# Altium project fotopolim_v0.PrjPCB
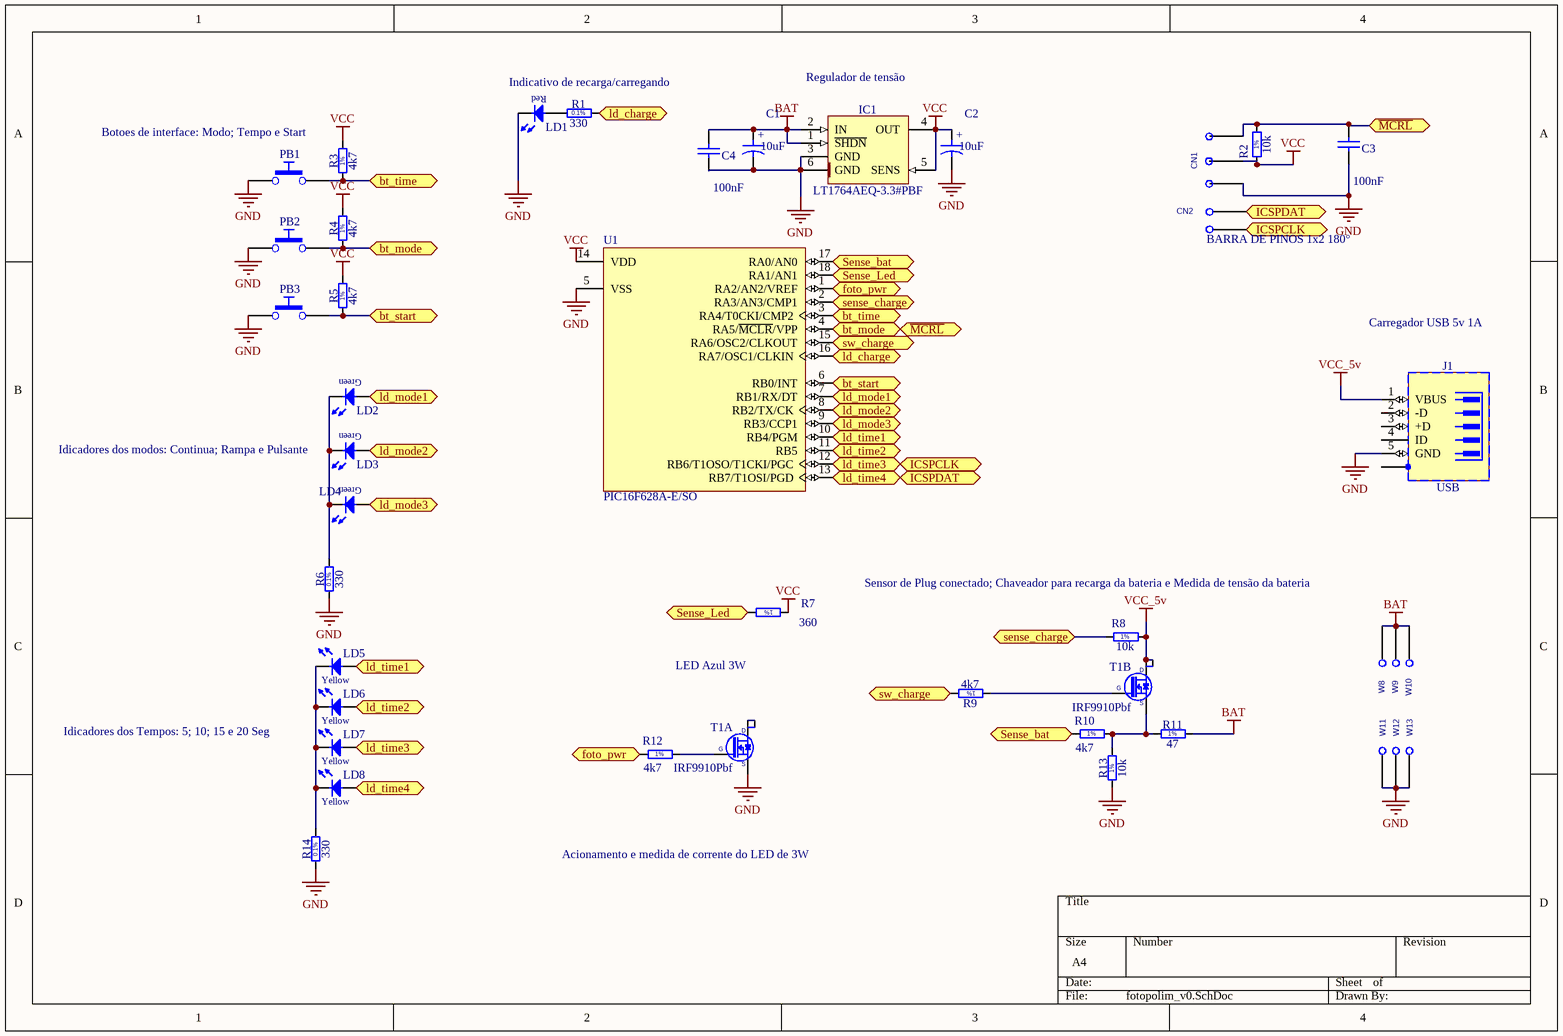
[diagram p0: fotopolim_v0.SchDoc]
1 sheet, 41 parts. Net scope: flat (ports and power ports of the same name join across sheets).
Board file: fotopolim_v0_C.PcbDoc

## Sheet fotopolim_v0.SchDoc
size A4

### Parts
C1  10uF  [CAPMP3528X210N]
C2  10uF  [CAPMP3528X210N]
C3  100nF  [CAPC2012X135N]
C4  100nF  [CAPC2012X135N]
CN1  BARRA DE PINOS 1x3 180°  [BARRA DE PINOS 1X3 180 - MACHO]  (value not drawn)
CN2  BARRA DE PINOS 1x2 180°  [BARRA DE PINOS 1X2 180 - MACHO]
IC1  LT1764AEQ-3.3#PBF  [TO170P1394X457-6N-R900X1060]
J1  USB  [WURTH_651005136521]
LD1  Red  [LEDM3528X210N_RED]  (value not drawn)
LD2  Green  [LED_OSRAM_LGR971]  (value not drawn)
LD3  Green  [LED_OSRAM_LGR971]  (value not drawn)
LD4  Green  [LED_OSRAM_LGR971]  (value not drawn)
LD5  Yellow  [LEDM3528X210N_YELLOW]  (value not drawn)
LD6  Yellow  [LEDM3528X210N_YELLOW]  (value not drawn)
LD7  Yellow  [LEDM3528X210N_YELLOW]  (value not drawn)
LD8  Yellow  [LEDM3528X210N_YELLOW]  (value not drawn)
PB1  Push Button  [PB_TYCO_FSMSM]  (value not drawn)
PB2  Push Button  [PB_TYCO_FSMSM]  (value not drawn)
PB3  Push Button  [PB_TYCO_FSMSM]  (value not drawn)
R1  330  [RESC2012X60N]
R2  10k  [RESC2012X60N]
R3  4k7  [RESC2012X60N]
R4  4k7  [RESC2012X60N]
R5  4k7  [RESC2012X60N]
R6  330  [RESC2012X60N]
R7  360  [RESC6331X70N]
R8  10k  [RESC2012X60N]
R9  4k7  [RESC2012X60N]
R10  4k7  [RESC2012X60N]
R11  47  [RESC6331X70N]
R12  4k7  [RESC2012X60N]
R13  10k  [RESC2012X60N]
R14  330  [RESC2012X60N]
T1  IRF9910Pbf  [SOIC127P600X175-8N]  (parts A,B of 2)
U1  PIC16F628A-E/SO  [SOIC-SO18_L]
W8  CABO COM CLIP  [CABINHO COM CLIP]  (value not drawn)
W9  CABO COM CLIP  [CABINHO COM CLIP]  (value not drawn)
W10  CABO COM CLIP  [CABINHO COM CLIP]  (value not drawn)
W11  CABO COM CLIP  [CABINHO COM CLIP]  (value not drawn)
W12  CABO COM CLIP  [CABINHO COM CLIP]  (value not drawn)
W13  CABO COM CLIP  [CABINHO COM CLIP]  (value not drawn)

### Ports
bt_mode, bt_start, bt_time, foto_pwr, ICSPCLK, ICSPDAT, ld_charge, ld_mode1, ld_mode2, ld_mode3, ld_time1, ld_time2, ld_time3, ld_time4, Sense_bat, sense_charge, Sense_Led, sw_charge, ~{MCRL}

### Nets
BAT: C1.1 C4.2 IC1.1(~{SHDN}) IC1.2(IN) R11.2 W8.1 W9.1 W10.1
GND: C1.2 C2.2 C3.1 C4.1 CN1.1(P1) IC1.3(GND) IC1.6(GND) J1.5(GND) LD1.1(C) PB1.1 PB2.1 PB3.1 R6.1 R13.1 R14.1 T1.3(S) U1.5(VSS) W11.1 W12.1 W13.1
VCC: C2.1 CN1.2(P2) IC1.4(OUT) IC1.5(SENS) R2.1 R3.2 R4.2 R5.2 R7.1 U1.14(VDD)
VCC_5v: J1.1(VBUS) R8.2 T1.7(D) T1.8(D)
NetC3_2: C3.2 CN1.3(P3) PB2.2 R2.2 R4.1 U1.4(RA5/~{MCLR}/VPP) ; port bt_mode, port ~{MCRL}
NetCN2_1: CN2.1 LD8.2(A) U1.13(RB7/T1OSI/PGD) ; port ld_time4, port ICSPDAT
NetCN2_2: CN2.2 LD7.2(A) U1.12(RB6/T1OSO/T1CKI/PGC) ; port ld_time3, port ICSPCLK
NetLD1_2: LD1.2(A) R1.1
NetLD2_1: LD2.1(C) LD3.1(C) LD4.1(C) R6.2
NetLD2_2: LD2.2(A) U1.7(RB1/RX/DT) ; port ld_mode1
NetLD3_2: LD3.2(A) U1.8(RB2/TX/CK) ; port ld_mode2
NetLD4_2: LD4.2(A) U1.9(RB3/CCP1) ; port ld_mode3
NetLD5_1: LD5.1(C) LD6.1(C) LD7.1(C) LD8.1(C) R14.2
NetLD5_2: LD5.2(A) U1.10(RB4/PGM) ; port ld_time1
NetLD6_2: LD6.2(A) U1.11(RB5) ; port ld_time2
NetPB1_2: PB1.2 R3.1 U1.3(RA4/T0CKI/CMP2) ; port bt_time
NetPB3_2: PB3.2 R5.1 U1.6(RB0/INT) ; port bt_start
NetR1_2: R1.2 U1.16(RA7/OSC1/CLKIN) ; port ld_charge
NetR7_2: R7.2 U1.18(RA1/AN1) ; port Sense_Led
NetR8_1: R8.1 U1.2(RA3/AN3/CMP1) ; port sense_charge
NetR9_1: R9.1 T1.2(G)
NetR9_2: R9.2 U1.15(RA6/OSC2/CLKOUT) ; port sw_charge
NetR10_1: R10.1 U1.17(RA0/AN0) ; port Sense_bat
NetR10_2: R10.2 R11.1 R13.2 T1.1(S)
NetR12_1: R12.1 U1.1(RA2/AN2/VREF) ; port foto_pwr
NetR12_2: R12.2 T1.4(G)
NetT1_5: T1.5(D) T1.6(D)

Not connected (* = marked no-connect by the designer): J1 2(-D) 3(+D) 4(ID) 6(SH)

### Notes on the sheet
- Indicativo de recarga/carregando
- Regulador de tensão
- (near R3) Botoes de interface: Modo; Tempo e Start
- Carregador USB 5v 1A
- (near LD3) Idicadores dos modos: Continua; Rampa e Pulsante
- Sensor de Plug conectado; Chaveador para recarga da bateria e Medida de tensão da bateria
- LED Azul 3W
- Idicadores dos Tempos: 5; 10; 15 e 20 Seg
- Acionamento e medida de corrente do LED de 3W
- (in symbol CTE3528-21_10UF_16V_10%_LESR0800) +
- (in symbol R0805_4K7_1%_0.125W_100PPM) 1%
- (in symbol R0805_10K_1%_0.125W_100PPM) 1%
- (in symbol R0805_330R_0.1%_0.1W_25PPM) 0.1%
- (in symbol R2512_47R_1%_1W_100PPM) 1%
- (in symbol R2512_360R_1%_1W_100PPM) 1%

### Library data of the parts
C1 C2 = CTE3528-21_10UF_16V_10%_LESR0800: Polarised capacitor; Part Description: Low ESR 0R8 Solid Tantalum Chip Capacitor; Manufacturer: GENERIC; Manufacturer1 Part Number: TPSB106K016R0800; Voltage: 16V; Tolerance: ±10%; Table: Capacitors SMD; Part Number: CTE3528-21_10UF_16V_10%_LESR0800; Component Kind: Standard; Component Type: Standard; Pin Count: 2; Value: 10uF; Status: Preferred; Manufacturer Part Number: CTE3528-21_10UF_16V_10%_LESR0800; Case: B; Mounted: Yes; Socket: No; SMD: Yes; Manufacturer1 Example: AVX; Manufacturer1 ComponentHeight: 2.1mm; HelpURL: \\cern.ch\dfs\Applications\Altium\Datasheets\CTE-LESR_AVX_TPS.pdf; Author: CERN DEM JLC; CreateDate: 05/05/2008; LatestRevisionDate: 20/01/2009
C3 C4 = CC0805_100NF_50V_10%_X7R: Non-polarised capacitor; Part Description: SMD Multilayer Chip Ceramic Capacitor; Manufacturer: GENERIC; Manufacturer1 Part Number: B37941K5104K62; Voltage: 50V; TC: X7R; Tolerance: ±10%; Table: Capacitors SMD; Part Number: CC0805_100NF_50V_10%_X7R; Component Kind: Standard; Component Type: Standard; Pin Count: 2; Value: 100nF; Status: Preferred; Manufacturer Part Number: CC0805_100NF_50V_10%_X7R; Case: 0805; Mounted: Yes; Socket: No; SMD: Yes; HelpURL: \\cern.ch\dfs\Applications\Altium\Datasheets\CC0805_X7R_EPCOS.pdf; Author: CERN DEM JLC; CreateDate: 03/12/2007; LatestRevisionDate: 03/12/2007; Manufacturer1 Example: EPCOS; Manufacturer1 ComponentHeight: 1.35mm
CN1 = BARRA DE PINOS 1x3 180°: cod: 302003135; Descri: BARRA DE PINOS 1x3 180°; 3D comp: BARRA DE PINOS 1x3 180°; Compra: 302003135; SCH: BARRA DE PINOS 1x3 180°
CN2 = BARRA DE PINOS 1x2 180°: cod: 302003134; Descri: BARRA DE PINOS 1x2 180°; 3D comp: BARRA DE PINOS 1x2 180°; Compra: 302003134; SCH: BARRA DE PINOS 1x2 180°
IC1 = LT1764AEQ-3.3#PBF: 3A, Fast Transient Response, Low Noise, LDO Regulators; Manufacturer: LINEAR TECHNOLOGY; Part Number: LT1764AEQ-3.3#PBF; Component Kind: Standard; Component Type: Standard; Device: LT1764AEQ-3.3#PBF; PackageDescription: TO, 1.70mm Pitch; 5 Pin, 13.945mm L X 8.89mm W X 4.572mm H body, IPC Medium Density; Part Description: 3A, Fast Transient Response, Low Noise, LDO Regulators; Manufacturer Part Number: LT1764AEQ-3.3#PBF; Pin Count: 6; Case: TO-263; Mounted: Yes; Socket: No; SMD: Yes; ComponentHeight: 4.57mm; HelpURL: \\cern.ch\dfs\Applications\Altium\Datasheets\LT1764AEQ-3.3#PBF.pdf; Author: CERN DEM JLC; CreateDate: 27/03/2012; LatestRevisionDate: 27/03/2012; Table: Regulators
J1 = WURTH_651005136521: 5 Pin + 1 Shield USB Receptacle; Part Description: Mini USB Type B  Receptacle, Horizontal, 5 Contacts; Manufacturer: WURTH ELEKTRONIK; Table: Miscellaneous; Part Number: WURTH_651005136521; Component Kind: Standard; Component Type: Standard; Pin Count: 6; Family: USB; Mounted: Yes; Socket: No; SMD: No; Status: None; Manufacturer Part Number: 651005136521; ComponentHeight: 3.9mm; HelpURL: \\cern.ch\dfs\Applications\Altium\Datasheets\WURTH_651005136521.pdf; Author: CERN DEM JLC; CreateDate: 07/03/2011; LatestRevisionDate: 07/03/2011
LD1 = LED_OSRAM_LST676-Q1R2-1: LED Red 1C 2A; Part Description: Hyper TOPLED® SMD Super Red LED; Manufacturer: OSRAM; Table: LEDs & Displays; Part Number: LED_OSRAM_LST676-Q1R2-1; Component Kind: Standard; Component Type: Standard; Color: Red; PackageDescription: Molded LED, 2-Leads, Body 3.5x2.8mm, IPC Medium Density PCB Edge Mounting; Manufacturer Part Number: LST676-Q1R2-1; Pin Count: 2; Mounted: Yes; Socket: No; SMD: Yes; ComponentHeight: 1.2mm; HelpURL: \\cern.ch\dfs\Applications\Altium\Datasheets\LED_OSRAM_LST676-Q1R2-1.pdf; Author: CERN DEM JLC; CreateDate: 30/06/2008; LatestRevisionDate: 17/03/2010
LD2-LD4 = LED_OSRAM_LGR971: LED Green 1C 2A; Part Description: Surface Mount Green LED (0805 Case); Manufacturer: OSRAM; Manufacturer Part Number: LGR971; Table: LEDs & Displays; Part Number: LED_OSRAM_LGR971; Component Kind: Standard; Component Type: Standard; Color: Green; PackageDescription: Green Chip LED, 2-Leads, Body 2.0x1.25mm, IPC Medium Density; Pin Count: 2; Case: 0805; Mounted: Yes; Socket: No; SMD: Yes; ComponentHeight: 0.9mm; HelpURL: \\cern.ch\dfs\Applications\Altium\Datasheets\LED_OSRAM_LGR971.pdf; Author: CERN DEM JLC; CreateDate: 28/01/2009; LatestRevisionDate: 17/03/2010
LD5-LD8 = LED_OSRAM_LYT676-R1S2-26: LED Yellow 1C 2A; Part Description: Hyper TOPLED® SMD Yellow LED; Manufacturer: OSRAM; Table: LEDs & Displays; Part Number: LED_OSRAM_LYT676-R1S2-26; Component Kind: Standard; Component Type: Standard; Color: Yellow; PackageDescription: Molded LED, 2-Leads, Body 3.5x2.8mm, IPC Medium Density PCB Edge Mounting; Manufacturer Part Number: LY T676-R1S2-26; Pin Count: 2; Mounted: Yes; Socket: No; SMD: Yes; ComponentHeight: 1.2mm; HelpURL: \\cern.ch\dfs\Applications\Altium\Datasheets\LED_OSRAM_LYT676-R1S2-26.pdf; Author: CERN DEM JLC; CreateDate: 14/05/2008; LatestRevisionDate: 17/03/2010
PB1-PB3 = PB_TYCO_FSMSM: Push-Button Switch SPDT; Part Description: 12VDC 50mA SPST Tactile  Push-Button Switch; Manufacturer: TYCO ELECTRONICS; Manufacturer Part Number: FSMSM or 1437566-3; Table: Switches; Part Number: PB_TYCO_FSMSM; Component Kind: Standard; Component Type: Standard; Pin Count: 2; PackageDescription: Body 3.5x6.0mm, Pushbutton Switch,  TYCO ALCOSWITCH FSMSM Serie; Family: Push Button; Mounted: Yes; Socket: No; SMD: Yes; Status: None; ComponentHeight: 4.3mm; HelpURL: \\cern.ch\dfs\Applications\Altium\Datasheets\PB_TYCO_FSMSM.pdf; Author: CERN DEM JLC; CreateDate: 30/06/2008; LatestRevisionDate: 21/06/2012
R1 R6 R14 = R0805_330R_0.1%_0.1W_25PPM: Resistor - 0.1%; Part Description: Precision Surface Mount Resistor; Manufacturer: GENERIC; Manufacturer1 Part Number: PCF0805P-R-330R-BT1; Power: 0.1W; TC: ±25ppm/°C; Table: Resistors SMD; Part Number: R0805_330R_0.1%_0.1W_25PPM; Component Kind: Standard; Component Type: Standard; Pin Count: 2; Value: 330; Status: Not recommended; Tolerance: ±0.1%; Manufacturer Part Number: R0805_330R_0.1%_0.1W_25PPM; Case: 0805; Mounted: Yes; Socket: No; SMD: Yes; Manufacturer1 Example: WELWYN COMPONENTS; Manufacturer1 ComponentHeight: 0.5mm; HelpURL: \\cern.ch\dfs\Applications\Altium\Datasheets\R0805_WELWYN_PCF0805R.pdf; Author: CERN DEM JLC; CreateDate: 05/10/2010; LatestRevisionDate: 05/10/2010
R2 R8 R13 = R0805_10K_1%_0.125W_100PPM: Resistor - 1%; Part Description: General Purpose Thick Film Chip Resistor; Manufacturer: GENERIC; Manufacturer1 Part Number: NRC10F1002TRF; Power: 0.125W; TC: ±100ppm/°C; Table: Resistors SMD; Part Number: R0805_10K_1%_0.125W_100PPM; Component Kind: Standard; Component Type: Standard; Pin Count: 2; Value: 10k; Status: Preferred; Tolerance: ±1%; Manufacturer Part Number: R0805_10K_1%_0.125W_100PPM; Case: 0805; Mounted: Yes; Socket: No; SMD: Yes; Manufacturer1 Example: NIC COMPONENT; Manufacturer1 ComponentHeight: 0.6mm; HelpURL: \\cern.ch\dfs\Applications\Altium\Datasheets\R0805_NIC_NRC.pdf; Author: CERN DEM JLC; CreateDate: 03/12/2007; LatestRevisionDate: 13/03/2008
R3-R5 R9 R10 R12 = R0805_4K7_1%_0.125W_100PPM: Resistor - 1%; Part Description: General Purpose Thick Film Chip Resistor; Manufacturer: GENERIC; Manufacturer1 Part Number: NRC10F4701TRF; Power: 0.125W; TC: ±100ppm/°C; Table: Resistors SMD; Part Number: R0805_4K7_1%_0.125W_100PPM; Component Kind: Standard; Component Type: Standard; Pin Count: 2; Value: 4k7; Status: Preferred; Tolerance: ±1%; Manufacturer Part Number: R0805_4K7_1%_0.125W_100PPM; Case: 0805; Mounted: Yes; Socket: No; SMD: Yes; Manufacturer1 Example: NIC COMPONENT; Manufacturer1 ComponentHeight: 0.6mm; HelpURL: \\cern.ch\dfs\Applications\Altium\Datasheets\R0805_NIC_NRC.pdf; Author: CERN DEM JLC; CreateDate: 03/12/2007; LatestRevisionDate: 13/03/2008
R7 = R2512_360R_1%_1W_100PPM: Resistor - 1%; Part Description: Thick Film Chip Resistor; Manufacturer: GENERIC; Manufacturer1 Part Number: RC2512FK-07360RL; Power: 1W; TC: ±100ppm/°C; Table: Resistors SMD; Part Number: R2512_360R_1%_1W_100PPM; Component Kind: Standard; Component Type: Standard; Pin Count: 2; Value: 360; Status: Preferred; Tolerance: ±1%; Manufacturer Part Number: R2512_360R_1%_1W_100PPM; Case: 2512; Mounted: Yes; Socket: No; SMD: Yes; Manufacturer1 Example: YAGEO PHYCOMP; Manufacturer1 ComponentHeight: 0.65mm; HelpURL: \\cern.ch\dfs\Applications\Altium\Datasheets\R2512_Phycomp_RC2512.pdf; Author: CERN DEM JLC; CreateDate: 17/10/2012; LatestRevisionDate: 17/10/2012
R11 = R2512_47R_1%_1W_100PPM: Resistor - 1%; Part Description: Thick Film Chip Resistor; Manufacturer: GENERIC; Manufacturer1 Part Number: 232276364709L or RC2512FK-0747RL; Power: 1W; TC: ±100ppm/°C; Table: Resistors SMD; Part Number: R2512_47R_1%_1W_100PPM; Component Kind: Standard; Component Type: Standard; Pin Count: 2; Value: 47; Status: Preferred; Tolerance: ±1%; Manufacturer Part Number: R2512_47R_1%_1W_100PPM; Case: 2512; Mounted: Yes; Socket: No; SMD: Yes; HelpURL: \\cern.ch\dfs\Applications\Altium\Datasheets\R2512_Phycomp_RC2512.pdf; Author: CERN DEM JLC; CreateDate: 21/07/2008; LatestRevisionDate: 17/10/2012; Manufacturer1 Example: YAGEO PHYCOMP; Manufacturer1 ComponentHeight: 0.65mm
T1 = IRF9910Pbf: Dual SO-8 MOSFET For POL Cconverter; Part Description: 20V 10A(Q1) 20V 12A (Q2) Dual SO-8 MOSFET For POL Cconverter; Manufacturer: INTERNATIONAL RECTIFIER; Table: Transistors; Part Number: IRF9910Pbf; Component Kind: Standard; Component Type: Standard; Device: IRF9910Pbf; PackageDescription: SOIC 8, Pitch 1.27mm - Body 4x5mm, IPC Medium Density; Manufacturer Part Number: IRF9910Pbf; Pin Count: 8; Case: DO8; Mounted: Yes; Socket: No; SMD: Yes; ComponentHeight: 1.75mm; HelpURL: \\cern.ch\dfs\Applications\Altium\Datasheets\IRF9910Pbf.pdf; Author: CERN DEM JLC; CreateDate: 30/08/2010; LatestRevisionDate: 30/08/2010
U1 = PIC16F628A-E/SO: FLASH-Based 8-Bit CMOS Microcontroller with nanoWatt Technology, 2K (x14-Bit words) FLASH, 224 Bytes SRAM, 18-Pin SOIC, 3.0 to 5.5V Supply Range, Extended Temperature; Published: 11-Oct-2004; LatestRevisionDate: 29-Jan-2009; LatestRevisionNote: Sch. layout revised. 3D Model Removed.; DatasheetVersion: revF, Mar-2007; PackageVersion: revBB, Aug-2009; PackageReference: SOIC-SO18; Publisher: Altium Limited; PackageDescription: 18-Lead Plastic Small Outline (SO) - Wide 7.50mm Body [SOIC]; Supplier 1: Digi-Key; Supplier Part Number 1: PIC16F628A-E/SO-ND; Supplier 2: Farnell; Supplier Part Number 2: 1815860; Code_JEDEC: MS-013; ComponentLink1Description: Datasheet; ComponentLink1URL: http://ww1.microchip.com/downloads/en/DeviceDoc/40044F.pdf; ComponentLink2Description: Packaging Specification; ComponentLink2URL: http://www.microchip.com/stellent/groups/techpub_sg/documents/packagingspec/en012702.pdf; ComponentLink3Description: Microchip.com Home; ComponentLink3URL: http://www.microchip.com/
W8-W13 = CABO COM CLIP: cod: 300051572; 3D comp: CABO COM CLIP; Compra: 300051572; Descri: CABO COM CLIP; SCH: CABO COM CLIP